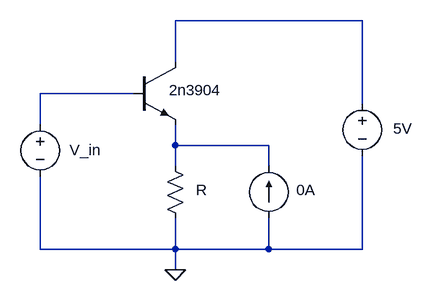
[diagram p0: schematic Experiment 3.asc]
Experiment 3.asc, the LTspice schematic file:
Version 4
SHEET 1 880 680
WIRE 608 -32 320 -32
WIRE 320 32 320 -32
WIRE 256 80 112 80
WIRE 608 96 608 -32
WIRE 112 128 112 80
WIRE 320 160 320 128
WIRE 464 160 320 160
WIRE 320 192 320 160
WIRE 464 192 464 160
WIRE 112 320 112 208
WIRE 320 320 320 272
WIRE 320 320 112 320
WIRE 464 320 464 272
WIRE 464 320 320 320
WIRE 608 320 608 176
WIRE 608 320 464 320
WIRE 320 352 320 320
FLAG 320 352 0
SYMBOL voltage 112 112 R0
WINDOW 0 24 16 Invisible 2
WINDOW 3 45 55 Left 2
SYMATTR InstName V1
SYMATTR Value V_in
SYMBOL voltage 608 80 R0
WINDOW 0 24 16 Invisible 2
WINDOW 3 48 54 Left 2
SYMATTR InstName V2
SYMATTR Value 5V
SYMBOL npn 256 32 R0
WINDOW 0 56 32 Invisible 2
WINDOW 3 54 43 Left 2
SYMATTR InstName Q1
SYMATTR Value 2n3904
SYMBOL res 304 176 R0
WINDOW 0 36 40 Invisible 2
WINDOW 3 48 53 Left 2
SYMATTR InstName R1
SYMBOL current 464 272 R180
WINDOW 0 24 80 Invisible 2
WINDOW 3 -72 43 Left 2
SYMATTR InstName I2
SYMATTR Value 0A

The netlist it stands for:
* Experiment 3.asc
V1 N002 0 V_in
V2 N001 0 5V
Q1 N001 N002 N003 0 2n3904
R1 N003 0 R
I2 0 N003 0A
.model NPN NPN
.model PNP PNP
.lib standard.bjt
.backanno
.end